# EAGLE design vusb (EAGLE 6.2)
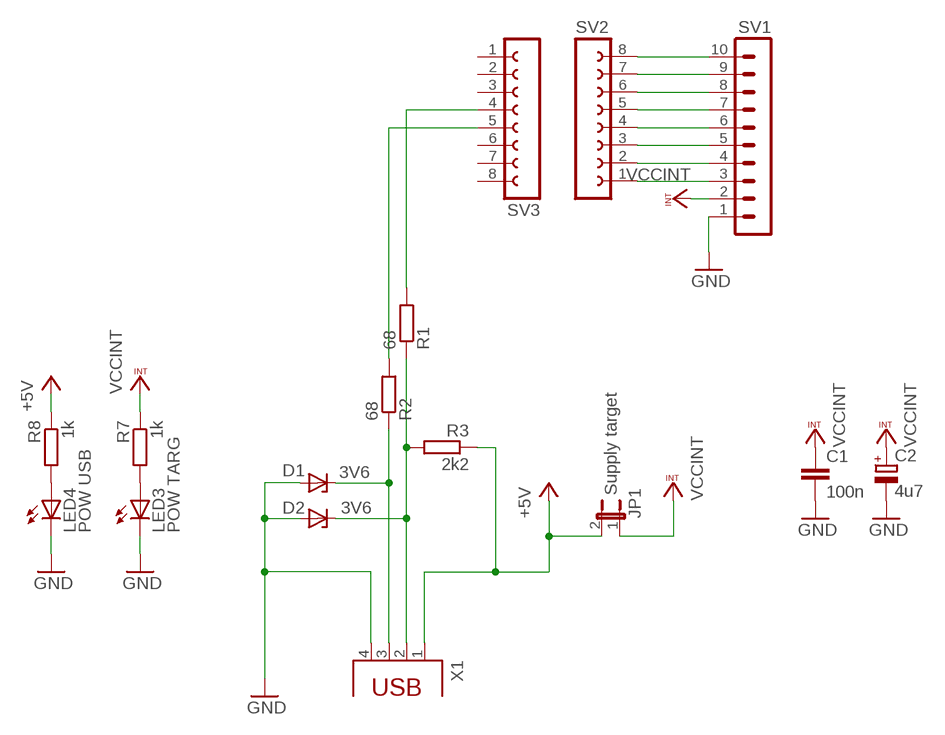
[diagram p0: schematic, sheet 1]

## Parts
C1  100n  C-EU025-024X044  [C025-024X044]
C2  4u7  CPOL-EUTT2D5  [TT2D5]
D1  3V6  ZENER-DIODEDO34-7  [DO34Z7]
D2  3V6  ZENER-DIODEZD-5  [ZDIO-5]
JP1  Supply target  JP1E  [JP1]
LED3  POW TARG  LED3MM  [LED3MM]
LED4  POW USB  LED3MM  [LED3MM]
R1  68  R-EU_0207/10  [0207/10]
R2  68  R-EU_0207/10  [0207/10]
R3  2k2  R-EU_0204/2V  [0204V]
R7  1k  R-EU_0207/10  [0207/10]
R8  1k  R-EU_0207/10  [0207/10]
SV1  MA10-1W  [MA10-1W]
SV2  FE08-1  [FE08]
SV3  FE08-1  [FE08]
X1  PN61729  [PN61729]

## Nets
GND: C1.2 C2.- D1.A D2.A LED3.K(C) LED4.K(C) SV1.1 X1.4
N$1: LED3.A R7.2
N$2: D1.C R2.1 X1.3
N$3: JP1.2 R3.1 R8.1 X1.1 ; supply symbol labelled +5V
N$4: LED4.A R8.2
N$5: D2.C R1.1 R3.2 X1.2
N$6: SV1.3 SV2.1
N$7: R1.2 SV3.4
N$8: SV1.4 SV2.2
N$9: SV1.5 SV2.3
N$11: SV1.6 SV2.4
N$12: SV1.7 SV2.5
N$13: SV1.8 SV2.6
N$14: SV1.9 SV2.7
N$15: SV1.10 SV2.8
N$16: R2.2 SV3.5
VCCINT: C1.1 C2.+ JP1.1 R7.1 SV1.2
Unconnected: SV3.1 SV3.2 SV3.3 SV3.6 SV3.7 SV3.8

## Library data of the parts
C1 = rcl:C-EU: CAPACITOR, European symbol
C2 = rcl:CPOL-EU: POLARIZED CAPACITOR, European symbol
D1 D2 = diode:ZENER-DIODE: Z-Diode
JP1 = jumper:JP1E: JUMPER
LED3 LED4 = led:LED: LED OSRAM: - CHIPLED LG R971, LG N971, LY N971, LG Q971, LY Q971, LO R971, LY R971 LH N974, LH R974 LS Q976, LO Q976, LY Q976 LO Q996 - Hyper CHIPLED LW Q18S LB Q993, LB Q99A, LB R99A - SideLED LS A670, LO A670, LY A670, LG A670, LP A670 LB A673, LV A673, LT A673, LW A673 LH A674 LY A675 LS A676, LA A676, LO A676, LY A676, LW A676 LS A679, LY A679, LG A679 - Hyper Micro SIDELED® LS Y876, LA Y876, LO Y876, LY Y876 LT Y87S - SmartLED LW L88C, LW L88S LB L89C, LB L89S, LG L890 LS L89K, LO L89K, LY L89K LS L896, LA L896, LO L896, LY L896 - TOPLED LS T670, LO T670, LY T670, LG T670, LP T670 LSG T670, LSP T670, LSY T670, LOP T670, LYG T670 LG T671, LOG T671, LSG T671 LB T673, LV T673, LT T673, LW T673 LH T674 LS T676, LA T676, LO T676, LY T676, LB T676, LH T676, LSB T676, LW T676 LB T67C, LV T67C, LT T67C, LS T67K, LO T67K, LY T67K, LW E67C LS E67B, LA E67B, LO E67B, LY E67B, LB E67C, LV E67C, LT E67C LW T67C LS T679, LY T679, LG T679 LS T770, LO T770, LY T770, LG T770, LP T770 LB T773, LV T773, LT T773, LW T773 LH T774 LS E675, LA E675, LY E675, LS T675 LS T776, LA T776, LO T776, LY T776, LB T776 LHGB T686 LT T68C, LB T68C - Hyper Mini TOPLED® LB M676 - Mini TOPLED Santana® LG M470 LS M47K, LO M47K, LY M47K Source: http://www.osram.convergy.de LUXEON: - LUMILED® LXK2-PW12-R00, LXK2-PW12-S00, LXK2-PW14-U00, LXK2-PW14-V00 LXK2-PM12-R00, LXK2-PM12-S00, LXK2-PM14-U00 LXK2-PE12-Q00, LXK2-PE12-R00, LXK2-PE12-S00, LXK2-PE14-T00, LXK2-PE14-U00 LXK2-PB12-K00, LXK2-PB12-L00, LXK2-PB12-M00, LXK2-PB14-N00, LXK2-PB14-P00, LXK2-PB14-Q00 LXK2-PR12-L00, LXK2-PR12-M00, LXK2-PR14-Q00, LXK2-PR14-R00 LXK2-PD12-Q00, LXK2-PD12-R00, LXK2-PD12-S00 LXK2-PH12-R00, LXK2-PH12-S00 LXK2-PL12-P00, LXK2-PL12-Q00, LXK2-PL12-R00 Source: www.luxeon.com KINGBRIGHT: KA-3528ASYC Source: www.kingbright.com
R1-R3 R7 R8 = rcl:R-EU_: RESISTOR, European symbol
SV1 = con-lstb:MA10-1W: PIN HEADER
SV2 SV3 = con-lsta:FE08-1: FEMALE HEADER
X1 = con-berg:PN61729: BERG USB connector

## Board
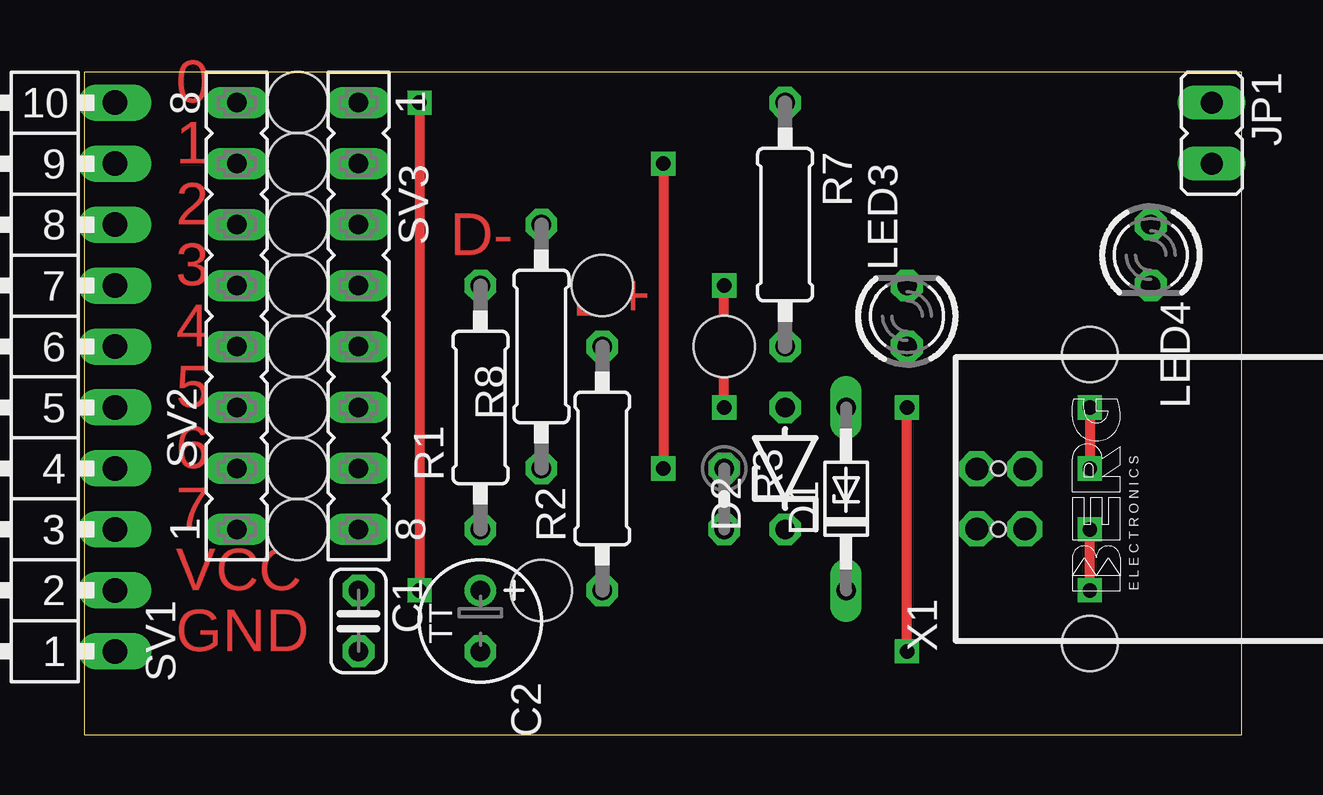
[diagram p1: board, top side]
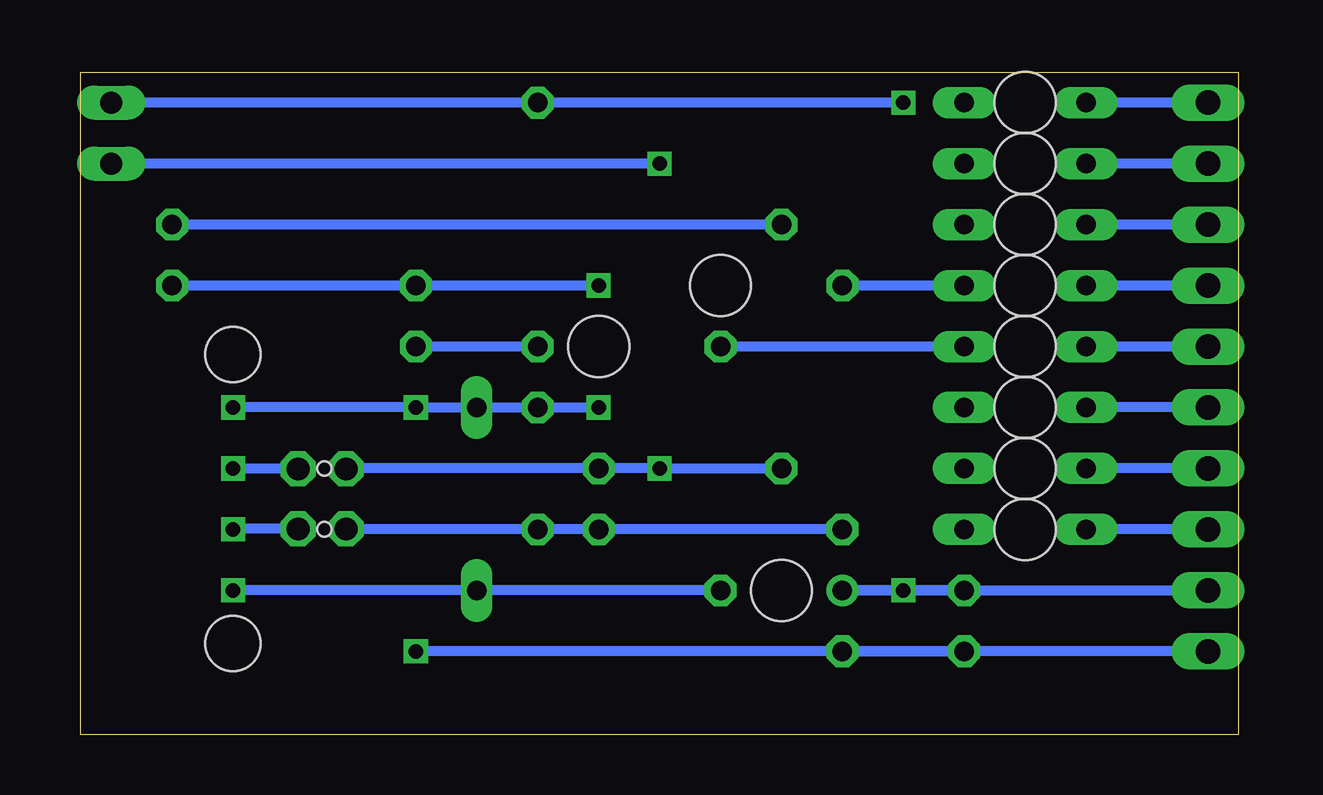
[diagram p2: board, bottom side, seen from below]

Size 48.25 x 27.61 mm. Coordinates in mm from the lower left corner, seen from the top.
Outline: 0,27.61 0,0 48.25,0 48.25,27.61 0,27.61
Copper layers (1*16): Top 0.035mm / dielectric 1.5mm / Bottom 0.035mm
Design rules: minimum track width 10mil, minimum drill 24mil, track to track 8mil, track to pad 8mil, pad to pad 8mil, via to via 8mil, smd to smd 8mil, copper to edge 40mil, drill to drill 8mil, minimum pad ring 10mil, minimum via ring 8mil, stop-mask expansion 4mil, vias tented up to drill 0mil, thermal gap 10mil
Holes 0.6 mm at 38.1,8.56 38.1,11.1
Holes 2.54 mm at 26.67,16.18 8.89,26.34 8.89,23.8 8.89,21.26 8.89,18.72 8.89,16.18 8.89,16.18 8.89,13.64 8.89,11.1 8.89,8.56 19.05,6.02 21.59,18.72

### Footprints (pad centres in the part's own frame; a part is rotated, then mirrored left to right if it is on the bottom)
C025-024X044 = drill 0.813 octagon: 1 -1.27,0; 2 1.27,0
TT2D5 = drill 0.813: + -1.27,0 | drill 0.813 octagon: - 1.27,0
DO34Z7 = drill 0.813 long: A 3.81,0; C -3.81,0
ZDIO-5 = drill 0.813 octagon: A 2.54,0; C -2.54,0
JP1 = drill 0.914 long: 1 0,-1.27; 2 0,1.27
LED3MM = drill 0.813 octagon: A -1.27,0; K 1.27,0
0207/10 = drill 0.813 octagon: 1 -5.08,0; 2 5.08,0
0204V = drill 0.813 octagon: 1 -1.27,0; 2 1.27,0
MA10-1W = drill 1.016 long: 1 -11.43,0; 2 -8.89,0; 3 -6.35,0; 4 -3.81,0; 5 -1.27,0; 6 1.27,0; 7 3.81,0; 8 6.35,0; 9 8.89,0; 10 11.43,0
FE08 = drill 0.813 long: 1 -8.89,0; 2 -6.35,0; 3 -3.81,0; 4 -1.27,0; 5 1.27,0; 6 3.81,0; 7 6.35,0; 8 8.89,0
PN61729 = drill 0.95 octagon: 1 1.25,4.71; 2 -1.25,4.71; 3 -1.25,2.71; 4 1.25,2.71 | hole 2.3: -6.02,0; 6.02,0

### Placement (x,y rotation side)
C1  11.43,4.75 270 top
C2  16.51,4.75 270 top
D1  31.75,9.83 90 top
D2  29.21,11.1 90 top
JP1  46.99,25.07 180 top
LED3  34.29,17.45 90 top
LED4  44.45,19.99 270 top
R1  16.51,13.64 90 top
R2  21.59,11.1 90 top
R3  26.67,9.83 270 top
R7  29.21,21.26 270 top
R8  19.05,16.18 90 top
SV1  1.27,14.91 90 top
SV2  6.35,17.45 90 top
SV3  11.43,17.45 270 top
X1  41.91,9.83 90 top

### Tracks (layer width: path | path; a pad name or v marks a point on that pad's centre or on a via)
GND  (via drill 0.6)
  Top 0.406: v34.29,3.48 v34.29,13.64 | v26.67,13.64 v26.67,18.72 | v41.91,13.64 v41.91,11.1
  Bottom 0.406: SV1.1 C2.- C1.2 v34.29,3.48 | v26.67,13.64 D2.A D1.A v34.29,13.64 v41.91,13.64 | v26.67,18.72 LED3.K LED4.K | X1.4 41.91,11.08 v41.91,11.1
N$1
  Bottom 0.406: R7.2 LED3.A
N$2  (via drill 0.6)
  Top 0.406: v41.91,6.02 v41.91,8.56
  Bottom 0.406: R2.1 D1.C v41.91,6.02 | X1.3 41.91,8.58 v41.91,8.56
N$3  (via drill 0.6)
  Top 0.406: v24.13,23.8 v24.13,11.1
  Bottom 0.406: X1.1 37.2,11.1 R3.1 v24.13,11.1 R8.1 | v24.13,23.8 JP1.2
N$4
  Bottom 0.406: R8.2 LED4.A
N$5
  Bottom 0.406: X1.2 37.2,8.56 D2.C R3.2 R1.1
N$6
  Bottom 0.406: SV1.3 SV2.1
N$7
  Bottom 0.406: SV3.4 R1.2
N$8
  Bottom 0.406: SV1.4 SV2.2
N$9
  Bottom 0.406: SV1.5 SV2.3
N$11
  Bottom 0.406: SV1.6 SV2.4
N$12
  Bottom 0.406: SV1.7 SV2.5
N$13
  Bottom 0.406: SV1.8 SV2.6
N$14
  Bottom 0.406: SV1.9 SV2.7
N$15
  Bottom 0.406: SV1.10 SV2.8
N$16
  Bottom 0.406: SV3.5 R2.2
VCCINT  (via drill 0.6)
  Top 0.406: v13.97,26.34 v13.97,6.02
  Bottom 0.406: v13.97,6.02 C1.1 C2.+ SV1.2 | v13.97,26.34 R7.1 JP1.1

### Text on the board
Top: 0 | 1 | 2 | D- | 3 | D+ | 4 | 5 | 6 | 7 | VCC | GND